# EAGLE design ATtiny programator1.1 (EAGLE 8.7.1)
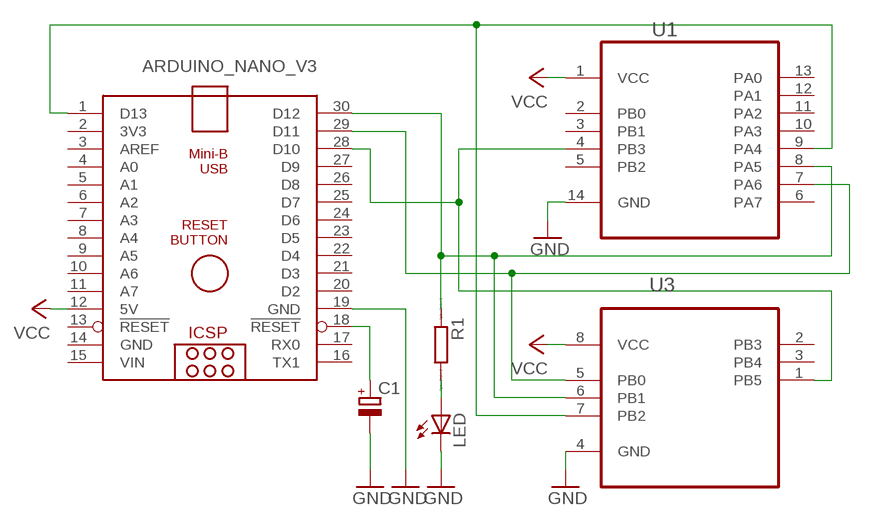
[diagram p0: schematic, sheet 1]

## Parts
ARDUINO_NANO_V3  ARDUINO_NANO  [ARDUINO_NANO]
C1  CPOL-EUTT2D4  [TT2D4]
LED  LED3MM  [LED3MM]
R1  R0204/7  [0204/7]
U1  ATTINY84-20PU  [DIP254P762X533-14]
U3  ATTINY45-20PU  [DIP254P762X533-8]

## Nets
GND: ARDUINO_NANO_V3.19(GND) C1.- LED.K(C) U1.14(GND) U3.4(GND)
MISO: ARDUINO_NANO_V3.30(D12) R1.1 U1.8(PA5) U3.6(PB1)
MOSI: ARDUINO_NANO_V3.29(D11) U1.7(PA6) U3.5(PB0)
N$1: LED.A R1.2
N$2: ARDUINO_NANO_V3.18(!RESET) C1.+
SCK: ARDUINO_NANO_V3.1(D13) U1.9(PA4) U3.7(PB2)
SS: ARDUINO_NANO_V3.28(D10) U1.4(PB3) U3.1(PB5)
VCC: ARDUINO_NANO_V3.12(5V) U1.1(VCC) U3.8(VCC)
Unconnected: ARDUINO_NANO_V3.2(3V3) ARDUINO_NANO_V3.3(AREF) ARDUINO_NANO_V3.4(A0) ARDUINO_NANO_V3.5(A1) ARDUINO_NANO_V3.6(A2) ARDUINO_NANO_V3.7(A3) ARDUINO_NANO_V3.8(A4) ARDUINO_NANO_V3.9(A5) ARDUINO_NANO_V3.10(A6) ARDUINO_NANO_V3.11(A7) ARDUINO_NANO_V3.13(!RESET) ARDUINO_NANO_V3.16(TX1) ARDUINO_NANO_V3.17(RX0) ARDUINO_NANO_V3.20(D2) ARDUINO_NANO_V3.21(D3) ARDUINO_NANO_V3.22(D4) ARDUINO_NANO_V3.23(D5) ARDUINO_NANO_V3.24(D6) ARDUINO_NANO_V3.25(D7) ARDUINO_NANO_V3.26(D8) ARDUINO_NANO_V3.27(D9) U1.2(PB0) U1.3(PB1) U1.5(PB2) U1.6(PA7) U1.10(PA3) U1.11(PA2) U1.12(PA1) U1.13(PA0) U3.2(PB3) U3.3(PB4)

## Power pins joined to a net without a drawn wire
GND: ARDUINO_NANO_V3.14(GND)
VIN: ARDUINO_NANO_V3.15(VIN)

## Library data of the parts
ARDUINO_NANO_V3 = ArduinoNanoV30_x:ARDUINO_NANO: Arduino Nano V3.0 Overview: The Arduino Nano is a small, complete, and breadboard-friendly board based on the ATmega328 (Arduino Nano 3.x) or ATmega168 (Arduino Nano 2.x). It has more or less the same functionality of the Arduino Duemilanove, but in a different package. It lacks only a DC power jack, and works with a Mini-B USB cable instead of a standard one. The Nano was designed and is being produced by Gravitech. Specifications: Microcontroller Atmel ATmega168 or ATmega328 Operating Voltage (logic level) 5 V Input Voltage (recommended) 7-12 V Input Voltage (limits) 6-20 V Digital I/O Pins 14 (of which 6 provide PWM output) Analog Input Pins 8 DC Current per I/O Pin 40 mA Flash Memory 16 KB (ATmega168) or 32 KB (ATmega328) of which 2 KB used by bootloader SRAM 1 KB (ATmega168) or 2 KB (ATmega328) EEPROM 512 bytes (ATmega168) or 1 KB (ATmega328) Clock Speed 16 MHz Dimensions 0.73" x 1.70" Length 45 mm Width 18 mm Weigth 5 g Power: The Arduino Nano can be powered via the Mini-B USB connection, 6-20V unregulated external power supply (pin 30), or 5V regulated external power supply (pin 27). The power source is automatically selected to the highest voltage source. Memory: The ATmega168 has 16 KB of flash memory for storing code (of which 2 KB is used for the bootloader); the ATmega328 has 32 KB, (also with 2 KB used for the bootloader). The ATmega168 has 1 KB of SRAM and 512 bytes of EEPROM (which can be read and written with the EEPROM library); the ATmega328 has 2 KB of SRAM and 1 KB of EEPROM. Input and Output: Each of the 14 digital pins on the Nano can be used as an input or output, using pinMode(), digitalWrite(), and digitalRead() functions. They operate at 5 volts. Each pin can provide or receive a maximum of 40 mA and has an internal pull-up resistor (disconnected by default) of 20-50 kOhms. In addition, some pins have specialized functions. Visit Arduino - ArduinoBoardNano <https://www.arduino.cc/en/Main/ArduinoBoardNano>
C1 = rcl:CPOL-EU: POLARIZED CAPACITOR, European symbol; SPICEPREFIX: C
LED = led:LED: LED OSRAM: - CHIPLED LG R971, LG N971, LY N971, LG Q971, LY Q971, LO R971, LY R971 LH N974, LH R974 LS Q976, LO Q976, LY Q976 LO Q996 - Hyper CHIPLED LW Q18S LB Q993, LB Q99A, LB R99A - SideLED LS A670, LO A670, LY A670, LG A670, LP A670 LB A673, LV A673, LT A673, LW A673 LH A674 LY A675 LS A676, LA A676, LO A676, LY A676, LW A676 LS A679, LY A679, LG A679 - Hyper Micro SIDELED® LS Y876, LA Y876, LO Y876, LY Y876 LT Y87S - SmartLED LW L88C, LW L88S LB L89C, LB L89S, LG L890 LS L89K, LO L89K, LY L89K LS L896, LA L896, LO L896, LY L896 - TOPLED LS T670, LO T670, LY T670, LG T670, LP T670 LSG T670, LSP T670, LSY T670, LOP T670, LYG T670 LG T671, LOG T671, LSG T671 LB T673, LV T673, LT T673, LW T673 LH T674 LS T676, LA T676, LO T676, LY T676, LB T676, LH T676, LSB T676, LW T676 LB T67C, LV T67C, LT T67C, LS T67K, LO T67K, LY T67K, LW E67C LS E67B, LA E67B, LO E67B, LY E67B, LB E67C, LV E67C, LT E67C LW T67C LS T679, LY T679, LG T679 LS T770, LO T770, LY T770, LG T770, LP T770 LB T773, LV T773, LT T773, LW T773 LH T774 LS E675, LA E675, LY E675, LS T675 LS T776, LA T776, LO T776, LY T776, LB T776 LHGB T686 LT T68C, LB T68C - Hyper Mini TOPLED® LB M676 - Mini TOPLED Santana® LG M470 LS M47K, LO M47K, LY M47K Source: http://www.osram.convergy.de LUXEON: - LUMILED® LXK2-PW12-R00, LXK2-PW12-S00, LXK2-PW14-U00, LXK2-PW14-V00 LXK2-PM12-R00, LXK2-PM12-S00, LXK2-PM14-U00 LXK2-PE12-Q00, LXK2-PE12-R00, LXK2-PE12-S00, LXK2-PE14-T00, LXK2-PE14-U00 LXK2-PB12-K00, LXK2-PB12-L00, LXK2-PB12-M00, LXK2-PB14-N00, LXK2-PB14-P00, LXK2-PB14-Q00 LXK2-PR12-L00, LXK2-PR12-M00, LXK2-PR14-Q00, LXK2-PR14-R00 LXK2-PD12-Q00, LXK2-PD12-R00, LXK2-PD12-S00 LXK2-PH12-R00, LXK2-PH12-S00 LXK2-PL12-P00, LXK2-PL12-Q00, LXK2-PL12-R00 Source: www.luxeon.com KINGBRIGHT: KA-3528ASYC Source: www.kingbright.com
R1 = eagle-ltspice:R: RESISTOR, European symbol; SPICEMODEL: NONE; SPICEPREFIX: R
U1 = Atmel_By_element14_Batch_1-00:ATTINY84-20PU: 8-bit Microcontroller with In-System Programmable Flash; MPN: ATTINY84-20PU; OC_FARNELL: -; OC_NEWARK: 58M3794; PACKAGE: PDIP-14; SUPPLIER: Atmel
U3 = Atmel_By_element14_Batch_1-00:ATTINY45-20PU: 8-bit Microcontroller with 2/4/8KBytes In-System Programmable Flash; MPN: ATTINY45-20PU; OC_FARNELL: 1288352; OC_NEWARK: 23M5072; PACKAGE: PDIP-8; SUPPLIER: Atmel

## Board
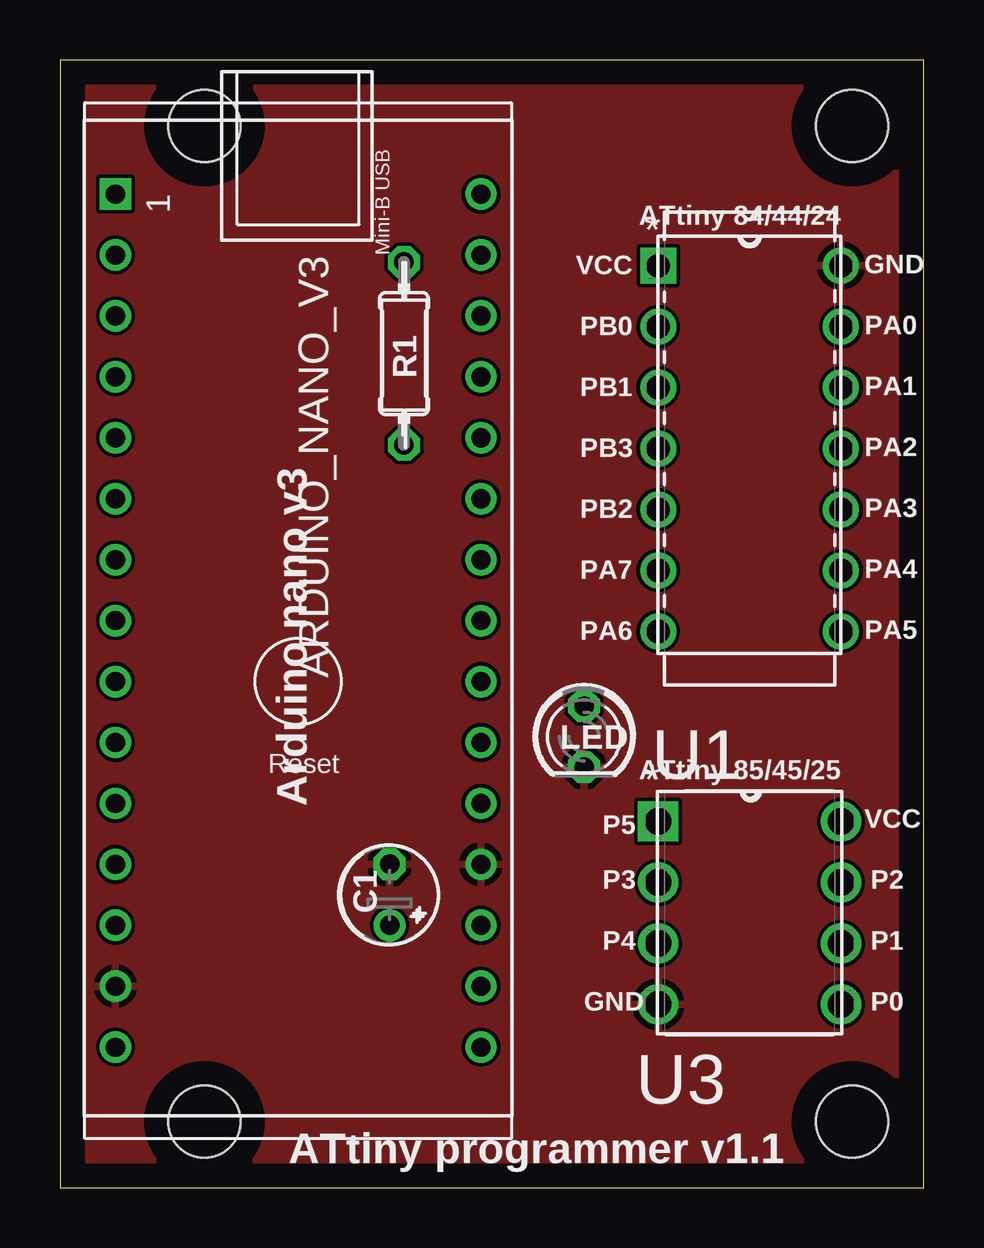
[diagram p1: board, top side]
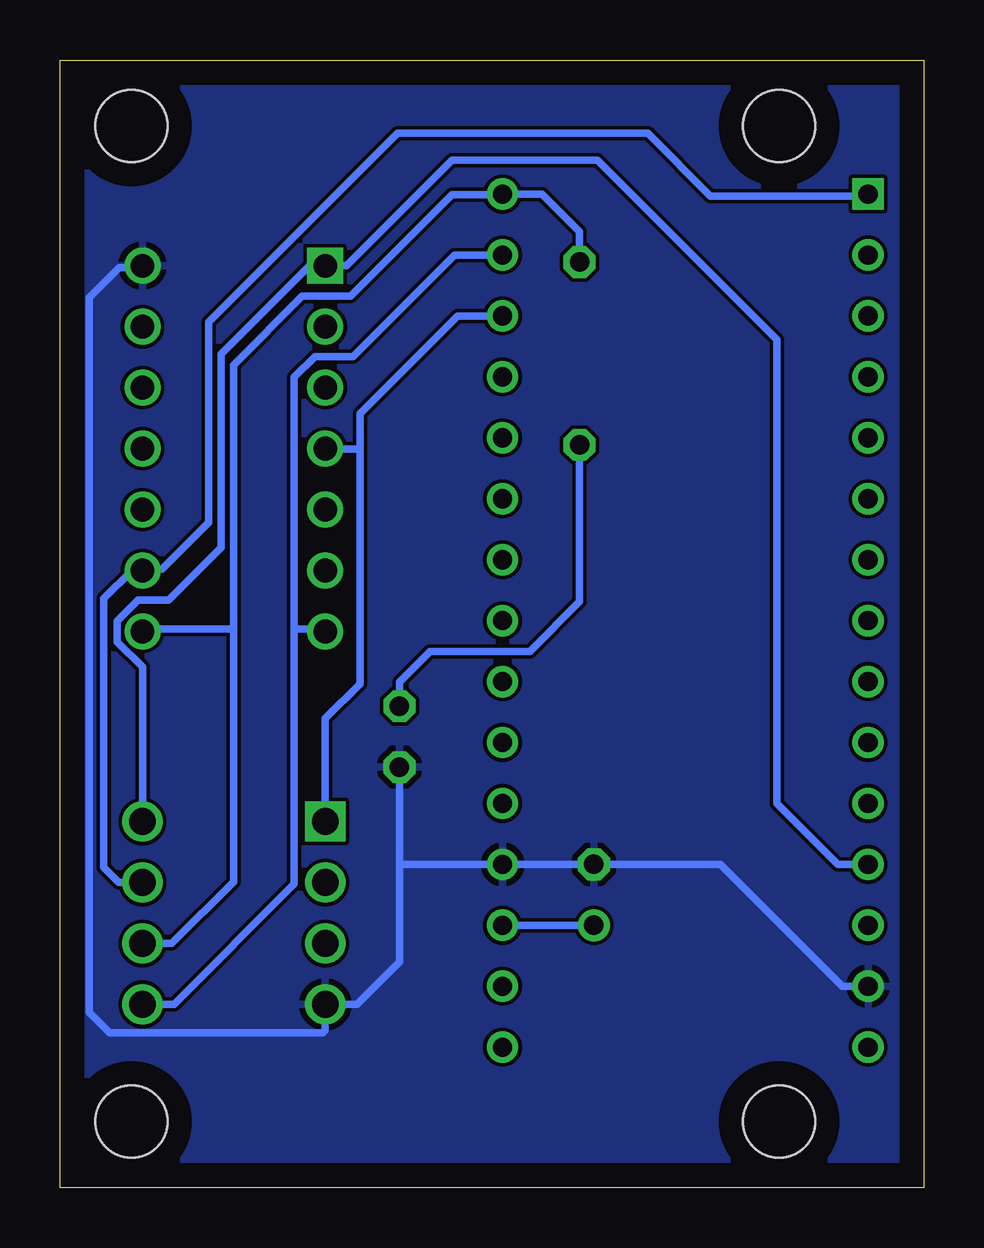
[diagram p2: board, bottom side, seen from below]

Size 36 x 47 mm. Coordinates in mm from the lower left corner, seen from the top.
Outline: 0,0 36,0 36,47 0,47 0,0
Copper layers (1*16): Top 0.035mm / dielectric 1.5mm / Bottom 0.035mm
Design rules "default": minimum track width 6mil, minimum drill 0.35mm, track to track 6mil, track to pad 6mil, pad to pad 6mil, via to via 6mil, smd to smd 6mil, copper to edge 40mil, drill to drill 6mil, minimum pad ring 10mil, minimum via ring 8mil, stop-mask expansion 4mil, vias tented up to drill 0mil, thermal gap 10mil
Holes 3 mm at 6.02,2.75 33.02,2.75 6.02,44.25 33.02,44.25

### Footprints (pad centres in the part's own frame; a part is rotated, then mirrored left to right if it is on the bottom)
ARDUINO_NANO = drill 0.8 square: 1 -20.32,-7.62 | drill 0.8: 2 -17.78,-7.62; 3 -15.24,-7.62; 4 -12.7,-7.62; 5 -10.16,-7.62; 6 -7.62,-7.62; 7 -5.08,-7.62; 8 -2.54,-7.62; 9 0,-7.62; 10 2.54,-7.62; 11 5.08,-7.62; 12 7.62,-7.62; 13 10.16,-7.62; 14 12.7,-7.62; 15 15.24,-7.62; 16 15.24,7.62; 17 12.7,7.62; 18 10.16,7.62; 19 7.62,7.62; 20 5.08,7.62; 21 2.54,7.62; 22 0,7.62; 23 -2.54,7.62; 24 -5.08,7.62; 25 -7.62,7.62; 26 -10.16,7.62; 27 -12.7,7.62; 28 -15.24,7.62; 29 -17.78,7.62; 30 -20.32,7.62
TT2D4 = drill 0.813: + -1.27,0 | drill 0.813 octagon: - 1.27,0
LED3MM = drill 0.813 octagon: A -1.27,0; K 1.27,0
0204/7 = drill 0.813 octagon: 1 -3.81,0; 2 3.81,0
DIP254P762X533-14 = drill 0.991 square: 1 -7.62,15.24 | drill 0.991: 2 -7.62,12.7; 3 -7.62,10.16; 4 -7.62,7.62; 5 -7.62,5.08; 6 -7.62,2.54; 7 -7.62,0; 8 0,0; 9 0,2.54; 10 0,5.08; 11 0,7.62; 12 0,10.16; 13 0,12.7; 14 0,15.24
DIP254P762X533-8 = drill 1.118 square: 1 -7.62,7.62 | drill 1.118: 2 -7.62,5.08; 3 -7.62,2.54; 4 -7.62,0; 5 0,0; 6 0,2.54; 7 0,5.08; 8 0,7.62

### Placement (x,y rotation side)
ARDUINO_NANO_V3  9.93,21.09 270 top
C1  13.74,12.2 90 top
LED  21.84,18.8 270 top
R1  14.34,34.76 270 top
U1  32.56,23.18 0 top
U3  32.56,7.64 0 top

### Tracks (layer width: path | path; a pad name or v marks a point on that pad's centre or on a via)
GND
  Bottom 0.305: ARDUINO_NANO_V3.14 3.39,8.39 8.47,13.47 C1.- ARDUINO_NANO_V3.19 21.84,13.47 21.84,13.46 | U1.14 32.63,38.35 33.53,38.35 34.78,37.1 34.78,7.3 33.93,6.44 25.05,6.44 24.94,6.56 U3.4 23.62,7.64 21.84,9.41 21.84,13.46 | 21.88,17.24 21.85,17.27 LED.K 21.84,13.46
  pour Bottom: 0,46.99 0,0 36.07,0 36.07,46.99
  pour Top: -0.25,-0.25 36.32,-0.25 36.32,47.24 -0.25,47.24
MISO
  Bottom 0.305: U3.6 31.34,10.18 28.77,12.75 28.77,23.28 | U1.8 32.46,23.28 28.77,23.28 | R1.1 14.34,39.84 15.91,41.41 ARDUINO_NANO_V3.30 17.58,41.38 19.66,41.38 23.88,37.16 25.9,37.16 28.77,34.29 28.77,23.28
MOSI
  Bottom 0.305: U3.5 31.24,7.64 26.23,12.65 26.23,23.28 | U1.7 25.04,23.28 26.23,23.28 | 26.23,23.28 26.23,33.78 25.37,34.65 23.78,34.65 19.56,38.87 ARDUINO_NANO_V3.29
N$1
  Bottom 0.305: R1.2 14.34,24.42 16.41,22.35 20.57,22.35 21.84,21.08 LED.A
N$2
  Bottom 0.305: C1.+ ARDUINO_NANO_V3.18
SCK
  Bottom 0.305: ARDUINO_NANO_V3.1 2.39,41.33 8.88,41.33 11.5,43.95 21.93,43.95 29.81,36.07 29.81,27.72 31.75,25.78 32.5,25.78 U1.9 33,25.72 34.17,24.55 34.17,13.35 33.54,12.72 U3.7
SS
  Bottom 0.305: U1.4 24.92,30.78 23.5,30.78 | U3.1 24.94,19.56 23.5,21 23.5,30.78 | ARDUINO_NANO_V3.28 19.43,36.33 23.5,32.26 23.5,30.78
VCC
  Bottom 0.305: ARDUINO_NANO_V3.12 3.58,13.47 6.12,16.01 6.12,35.34 13.6,42.82 19.66,42.82 24.06,38.42 U1.1 25.59,38.42 29.28,34.74 29.28,26.67 31.46,24.48 32.75,24.48 33.61,23.62 33.61,22.74 32.56,21.69 U3.8

### Text on the board
_tsilk: ATtiny 84/44/24 | VCC | GND | PB0 | PA0 | PB1 | PA1 | PB3 | PA2 | PB2 | PA3 | PA7 | PA4 | PA6 | PA5 | ATtiny 85/45/25 | Arduino nano v3 | P5 | VCC | P3 | P2 | P4 | P1 | GND | P0 | ATtiny programmer v1.1